# Altium schematic sheet [2] MicroController.SchDoc
size A4; SheetNumber: 2; SheetTotal: 3
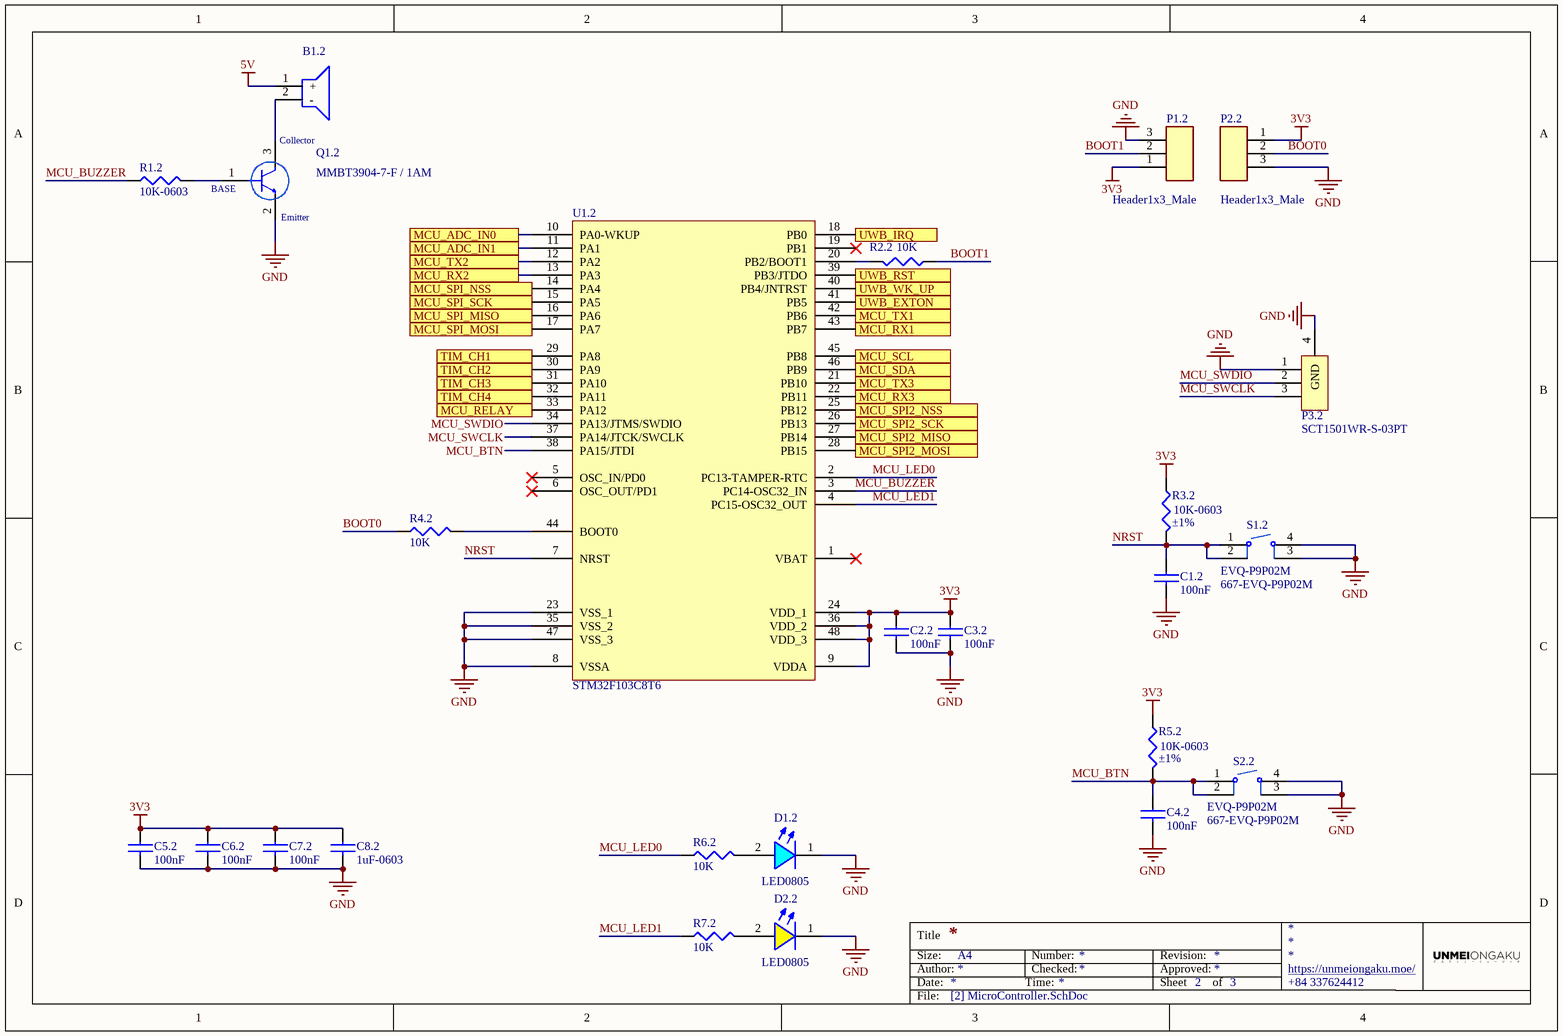
[diagram p0: [2] MicroController.SchDoc]

## Parts
B1.2  Buzzer  [Buzzer 9x5mm 60dB]  (value not drawn)
C1.2  100nF  [CAP0603]
C2.2  100nF  [CAP0603]
C3.2  100nF  [CAP0603]
C4.2  100nF  [CAP0603]
C5.2  100nF  [CAP0603]
C6.2  100nF  [CAP0603]
C7.2  100nF  [CAP0603]
C8.2  1uF-0603  [CAP0603]
D1.2  LED0805  [LED0805-BLUE]
D2.2  LED0805  [LED0805-YELLOW]
P1.2  Header1x3_Male  [HDR1x3_2.54_MALE]
P2.2  Header1x3_Male  [HDR1x3_2.54_MALE]
P3.2  SCT1501WR-S-03PT  [Connector ZH1.5 3P SMD]
Q1.2  MMBT3904-7-F / 1AM  [SOT23]
R1.2  10K-0603  [RES0603 - 3D]
R2.2  10K  [RES0603 - 3D]
R3.2  10K-0603  Tolerance: ±1%  [RES0603 - 3D]
R4.2  10K  [RES0603 - 3D]
R5.2  10K-0603  Tolerance: ±1%  [RES0603 - 3D]
R6.2  10K  [RES0603 - 3D]
R7.2  10K  [RES0603 - 3D]
S1.2  EVQ-P9P02M  Supplier Part Number 1: 667-EVQ-P9P02M  [TactileSwitch,SMT,4.2x3.2x2.5mm,4N]
S2.2  EVQ-P9P02M  Supplier Part Number 1: 667-EVQ-P9P02M  [TactileSwitch,SMT,4.2x3.2x2.5mm,4N]
U1.2  STM32F103C8T6  [LQFP48_L]

## Ports
MCU_ADC_IN0, MCU_ADC_IN1, MCU_RELAY, MCU_RX1, MCU_RX2, MCU_RX3, MCU_SCL, MCU_SDA, MCU_SPI2_MISO, MCU_SPI2_MOSI, MCU_SPI2_NSS, MCU_SPI2_SCK, MCU_SPI_MISO, MCU_SPI_MOSI, MCU_SPI_NSS, MCU_SPI_SCK, MCU_TX1, MCU_TX2, MCU_TX3, TIM_CH1, TIM_CH2, TIM_CH3, TIM_CH4, UWB_EXTON, UWB_IRQ, UWB_RST, UWB_WK_UP

## Nets
3V3: C2.2.1 C3.2.1 C5.2.1 C6.2.1 C7.2.1 C8.2.1 P1.2.1 P2.2.1 R3.2.1 R5.2.1 U1.2.9(VDDA) U1.2.24(VDD_1) U1.2.36(VDD_2) U1.2.48(VDD_3)
5V: B1.2.1(+)
GND: C1.2.2 C2.2.2 C3.2.2 C4.2.2 C5.2.2 C6.2.2 C7.2.2 C8.2.2 D1.2.1(+) D2.2.1(+) P1.2.3 P2.2.3 P3.2.1 P3.2.4(GND) Q1.2.2 S1.2.3 S1.2.4 S2.2.3 S2.2.4 U1.2.8(VSSA) U1.2.23(VSS_1) U1.2.35(VSS_2) U1.2.47(VSS_3)
BOOT0: P2.2.2 R4.2.1
BOOT1: P1.2.2 R2.2.1
MCU_ADC_IN0: U1.2.10(PA0-WKUP) ; port MCU_ADC_IN0
MCU_ADC_IN1: U1.2.11(PA1) ; port MCU_ADC_IN1
MCU_BTN: C4.2.1 R5.2.2 S2.2.1 S2.2.2 U1.2.38(PA15/JTDI)
MCU_BUZZER: R1.2.1 U1.2.3(PC14-OSC32_IN)
MCU_LED0: R6.2.1 U1.2.2(PC13-TAMPER-RTC)
MCU_LED1: R7.2.1 U1.2.4(PC15-OSC32_OUT)
MCU_RELAY: U1.2.33(PA12) ; port MCU_RELAY
MCU_RX1: U1.2.43(PB7) ; port MCU_RX1
MCU_RX2: U1.2.13(PA3) ; port MCU_RX2
MCU_RX3: U1.2.22(PB11) ; port MCU_RX3
MCU_SCL: U1.2.45(PB8) ; port MCU_SCL
MCU_SDA: U1.2.46(PB9) ; port MCU_SDA
MCU_SPI2_MISO: U1.2.27(PB14) ; port MCU_SPI2_MISO
MCU_SPI2_MOSI: U1.2.28(PB15) ; port MCU_SPI2_MOSI
MCU_SPI2_NSS: U1.2.25(PB12) ; port MCU_SPI2_NSS
MCU_SPI2_SCK: U1.2.26(PB13) ; port MCU_SPI2_SCK
MCU_SPI_MISO: U1.2.16(PA6) ; port MCU_SPI_MISO
MCU_SPI_MOSI: U1.2.17(PA7) ; port MCU_SPI_MOSI
MCU_SPI_NSS: U1.2.14(PA4) ; port MCU_SPI_NSS
MCU_SPI_SCK: U1.2.15(PA5) ; port MCU_SPI_SCK
MCU_SWCLK: P3.2.3 U1.2.37(PA14/JTCK/SWCLK)
MCU_SWDIO: P3.2.2 U1.2.34(PA13/JTMS/SWDIO)
MCU_TX1: U1.2.42(PB6) ; port MCU_TX1
MCU_TX2: U1.2.12(PA2) ; port MCU_TX2
MCU_TX3: U1.2.21(PB10) ; port MCU_TX3
NRST: C1.2.1 R3.2.2 S1.2.1 S1.2.2 U1.2.7(NRST)
TIM_CH1: U1.2.29(PA8) ; port TIM_CH1
TIM_CH2: U1.2.30(PA9) ; port TIM_CH2
TIM_CH3: U1.2.31(PA10) ; port TIM_CH3
TIM_CH4: U1.2.32(PA11) ; port TIM_CH4
UWB_EXTON: U1.2.41(PB5) ; port UWB_EXTON
UWB_IRQ: U1.2.18(PB0) ; port UWB_IRQ
UWB_RST: U1.2.39(PB3/JTDO) ; port UWB_RST
UWB_WK_UP: U1.2.40(PB4/JNTRST) ; port UWB_WK_UP
NetB1.2_2: B1.2.2(-) Q1.2.3
NetD1.2_2: D1.2.2(+) R6.2.2
NetD2.2_2: D2.2.2(+) R7.2.2
NetQ1.2_1: Q1.2.1 R1.2.2
NetR2.2_2: R2.2.2 U1.2.20(PB2/BOOT1)
NetR4.2_2: R4.2.2 U1.2.44(BOOT0)

Not connected (* = marked no-connect by the designer): U1.2 1(VBAT)* 5(OSC_IN/PD0)* 6(OSC_OUT/PD1)* 19(PB1)*

## Notes on the sheet
- Title
- Size:
- Date:
- Author:
- A4
- Time:
- Number:
- Checked:
- Revision:
- Sheet
- Approved:
- of
- https://unmeiongaku.moe/
- +84 337624412
- File:
- (in symbol MMBT3904-7-F / 1AM) Collector; BASE; Emitter

## Library data of the parts
B1.2 = Buzzer 9050 - DIP: 9050 DIP Buzzer 9x5mm 60dB; Local Supplier: thegioiic; Local Supplier Link: https://www.thegioiic.com/products/1209-dip-buzzer-12x9mm; Local Supplier Part Number: 1209 DIP Buzzer 12x9mm
C1.2 C2.2 C3.2 C4.2 C5.2 C6.2 C7.2 = CC0603KRX7R9BB104: CAP CER 0.1UF 50V X7R 0603; Manufacturer 1: Yageo; Category 1: Capacitors; Capacitance: 0.1µF; Tolerance: ±10%; Supplier 1: Digi-Key; Supplier Part Number 1: 311-1344-1-ND; Manufacturer Part Number 1: CC0603KRX7R9BB104; RoHS 1: RoHS Compliant; Description 1: CAP CER 0.1UF 50V X7R 0603; Stock 1: 4411645; Pricing 1: 1=0.1, 10=0.031, 100=0.014, 500=0.00998, 1000=0.00783 (USD); Packaging: Cut Tape (CT); Part Status: Active; Voltage - Rated: 50V; Temperature Coefficient: X7R; Operating Temperature: -55°C ~ 125°C; Features: -; Ratings: -; Applications: General Purpose; Failure Rate: -; Mounting Type: Surface Mount, MLCC; Package / Case: 0603 (1608 Metric); Size / Dimension: 0.063" L x 0.031" W (1.60mm x 0.80mm); Height - Seated (Max): -; Thickness (Max): 0.035" (0.90mm); Lead Spacing: -; Lead Style: -; ComponentLink1URL: http://www.yageo.com/documents/recent/UPY-GPHC_X7R_6.3V-to-50V_18.pdf; ComponentLink1Description: http://www.yageo.com/documents/recent/UPY-GPHC_X7R_6.3V-to-50V_18.pdf; Value: 100nF
C8.2 = CC0603KRX7R7BB105: CAP CER 1UF 16V X7R 0603; Manufacturer 1: Yageo; Category 1: Capacitors; Capacitance: 1µF; Tolerance: ±10%; Supplier 1: Digi-Key; Supplier Part Number 1: 311-1446-1-ND; Manufacturer Part Number 1: CC0603KRX7R7BB105; RoHS 1: RoHS Compliant; Description 1: CAP CER 1UF 16V X7R 0603; Stock 1: 274580; Pricing 1: 1=0.1, 10=0.051, 100=0.0227, 500=0.0162, 1000=0.01274 (USD); Packaging: Cut Tape (CT); Part Status: Active; Voltage - Rated: 16V; Temperature Coefficient: X7R; Operating Temperature: -55°C ~ 125°C; Features: -; Ratings: -; Applications: General Purpose; Failure Rate: -; Mounting Type: Surface Mount, MLCC; Package / Case: 0603 (1608 Metric); Size / Dimension: 0.063" L x 0.031" W (1.60mm x 0.80mm); Height - Seated (Max): -; Thickness (Max): 0.035" (0.90mm); Lead Spacing: -; Lead Style: -; ComponentLink1URL: http://www.yageo.com/documents/recent/UPY-GPHC_X7R_6.3V-to-50V_18.pdf; ComponentLink1Description: http://www.yageo.com/documents/recent/UPY-GPHC_X7R_6.3V-to-50V_18.pdf; Value: 1uF
D1.2 = LED0805-BLUE
D2.2 = LED0805-YELLOW
P1.2 P2.2 = HDR1x3_2.54_MALE: Header1x3_2.54_MALE
Q1.2 = MMBT3904-7-F / 1AM: Transistor General Purpose BJT NPN 40 Volt 0.2A Automotive 3-Pin SOT-23; Manufacturer: Diodes Zetex; Collector Emitter Breakdown Voltage: 40V; Max Power Dissipation: 300mW; Max Collector Current: 200mA; Transition Frequency: 300MHz; Collector Base Voltage (VCBO): 60V; Emitter Base Voltage (VEBO): 6V; Collector Emitter Saturation Voltage: 300mV; Element Configuration: Single; hFE Min: 100; Power Dissipation: 350mW; Number of Elements: 1; Supplier 1: Digi-Key; Manufacturer Part Number: MMBT3904-7-F; RoHS: Yes; Category: BJTs; Stock 1: 468030; Pricing 1: 3000=0.02271, 6000=0.02048, 15000=0.01781, 30000=0.01603, 75000=0.01425 (USD); Mount: Surface Mount; Case/Package: SOT-23; Number of Pins: 3; Contact Plating: Tin,Matte; Weight: 0.000282oz; Min Operating Temperature: -55°C; Max Operating Temperature: 150°C; Packaging: Tape and Reel; Polarity: NPN; Package Quantity: 3000; Collector Emitter Voltage (VCEO): 40V; Gain Bandwidth Product: 300MHz; Frequency: 300MHz; Max Breakdown Voltage: 40V; Series: -; Collector-emitter Voltage-Max: 300mV; Voltage Rating (DC): 40V; Max Frequency: 300MHz; Continuous Collector Current: 200mA; Length: 3.05mm; Width: 1.4mm; Height: 1mm; Radiation Hardening: No; RoHS Compliant: Yes; Lead Free: Lead Free; REACH SVHC: No SVHC; ComponentLink1URL: https://datasheet.ciiva.com/11201/ds30036-11201778.pdf?src-supplier=Avnet; ComponentLink1Description: https://datasheet.ciiva.com/11201/ds30036-11201778.pdf?src-supplier=Avnet; ComponentLink2URL: https://datasheet.ciiva.com/15138/getdatasheetpartid-53265-15138780.pdf?src-supplier=Verical; ComponentLink2Description: https://datasheet.ciiva.com/15138/getdatasheetpartid-53265-15138780.pdf?src-supplier=Verical; ComponentLink3URL: https://datasheet.ciiva.com/22711/1915516-22711750.pdf?src-supplier=Element14; ComponentLink3Description: https://datasheet.ciiva.com/22711/1915516-22711750.pdf?src-supplier=Element14; ComponentLink4URL: https://datasheet.ciiva.com/11198/ds30036-11198999.pdf?src-supplier=Avnet; ComponentLink4Description: https://datasheet.ciiva.com/11198/ds30036-11198999.pdf?src-supplier=Avnet; ComponentLink5URL: https://datasheet.ciiva.com/6361/ds30036-6361256.pdf?src-supplier=Digi-Key; ComponentLink5Description: https://datasheet.ciiva.com/6361/ds30036-6361256.pdf?src-supplier=Digi-Key; ComponentLink6URL: https://datasheet.ciiva.com/6361/ds30036-6361254.pdf?src-supplier=Digi-Key; ComponentLink6Description: https://datasheet.ciiva.com/6361/ds30036-6361254.pdf?src-supplier=Digi-Key; Supplier Part Number 1: MMBT3904-FDITR-ND
R1.2 = RC0603JR-0710KL: RES SMD 10K OHM 5% 1/10W 0603; Manufacturer 1: Yageo; Category 1: Resistors; Power (Watts): 0.1W, 1/10W; Temperature Coefficient: ±100ppm/°C; Supplier 1: Digi-Key; Supplier Part Number 1: 311-10KGRCT-ND; Manufacturer Part Number 1: RC0603JR-0710KL; RoHS 1: RoHS Compliant; Description 1: RES SMD 10K OHM 5% 1/10W 0603; Stock 1: 3056463; Pricing 1: 1=0.1, 10=0.011, 100=0.0044, 1000=0.00198, 2500=0.00172 (USD); Packaging: Cut Tape (CT); Part Status: Active; Resistance (Ohms): 10k; Tolerance: ±5%; Composition: Thick Film; Features: Moisture Resistant; Operating Temperature: -55°C ~ 155°C; Package / Case: 0603 (1608 Metric); Supplier Device Package: 0603; Size / Dimension: 0.063" L x 0.031" W (1.60mm x 0.80mm); Height - Seated (Max): 0.022" (0.55mm); Failure Rate: -; ComponentLink1URL: http://www.yageo.com/documents/recent/PYu-RC_Group_51_RoHS_L_7.pdf; ComponentLink1Description: http://www.yageo.com/documents/recent/PYu-RC_Group_51_RoHS_L_7.pdf; Value: 10K
R2.2 R3.2 R4.2 R5.2 R6.2 R7.2 = RC0603FR-0710KL: RES SMD 10K OHM 1% 1/10W 0603; Manufacturer: Yageo; Power (Watts): 0.1W, 1/10W; Temperature Coefficient: ±100ppm/°C; Supplier 1: Digi-Key; Manufacturer Part Number: RC0603FR-0710KL; RoHS: RoHS Compliant; Category: Resistors; Stock 1: 16545228; Pricing 1: 1=0.1, 10=0.015, 100=0.006, 1000=0.00268, 2500=0.00233 (USD); Packaging: Cut Tape (CT); Part Status: Active; Composition: Thick Film; Features: Moisture Resistant; Operating Temperature: -55°C ~ 155°C; Package / Case: 0603 (1608 Metric); Supplier Device Package: 0603; Size / Dimension: 0.063" L x 0.032" W (1.60mm x 0.80mm); Height - Seated (Max): 0.022" (0.55mm); Failure Rate: -; ComponentLink1URL: http://www.yageo.com/documents/recent/PYu-RC_Group_51_RoHS_L_7.pdf; ComponentLink1Description: http://www.yageo.com/documents/recent/PYu-RC_Group_51_RoHS_L_7.pdf; Supplier Part Number 1: 311-10.0KHRCT-ND; Value: 10K
  R2.2 R4.2 R6.2 R7.2: Tolerance: ±1%
S1.2 S2.2 = EVQ-P9P02M: Switch Tactile N.O. SPST Rectangular Button J-Bend 0.02A 15VDC 5N SMD Embossed Tape and Reel; Manufacturer: Panasonic; Mechanical Life: 200000Cycles; Operating Force: 500gf; Illumination Type: Non-Illuminated; Max Voltage Rating (DC): 15V; Switch Travel: 0.25mm; Switch Function: Off-Mom; Contact Current Rating: 20mA; Number of Positions: 2; Supplier 1: Mouser; Manufacturer Part Number: EVQ-P9P02M; RoHS: No; Category: Tactile Switches; Stock 1: 5205; Pricing 1: 1=0.83, 10=0.734, 50=0.734, 100=0.61, 1000=0.5, 10000=0.402 (USD); Mount: Surface Mount; Case/Package: SMD/SMT; Min Operating Temperature: -40°C; Max Operating Temperature: 85°C; Package Quantity: 4000; Packaging: Tape and Reel; Throw Configuration: SPST; Termination: J-Bend; Series: EVQP9; Size: 3.5mm; Radiation Hardening: No; Lead Free: Lead Free; RoHS Compliant: No; ComponentLink1URL: https://datasheet.ciiva.com/29974/atv0000ce7-29974075.pdf?src-supplier=Avnet; ComponentLink1Description: https://datasheet.ciiva.com/29974/atv0000ce7-29974075.pdf?src-supplier=Avnet; ComponentLink2URL: https://datasheet.ciiva.com/14920/atv0000ce7-14920757.pdf?src-supplier=Digikey; ComponentLink2Description: https://datasheet.ciiva.com/14920/atv0000ce7-14920757.pdf?src-supplier=Digikey; ComponentLink3URL: https://datasheet.ciiva.com/14920/atv0000ce7-14920758.pdf?src-supplier=Digikey; ComponentLink3Description: https://datasheet.ciiva.com/14920/atv0000ce7-14920758.pdf?src-supplier=Digikey
U1.2 = STM32F103C8T6: STM32 ARM-based 32-bit MCU with 64 Kbytes Flash, 48-pin LQFP, Industrial Temperature; ComponentLink1URL: www.st.com/stm32; ComponentLink1Description: Manufacturer Link; Published: 30-May-2008; DatasheetVersion: rev6, Mar-2008; PackageVersion: Mar-2008; PackageReference: LQFP48; Publisher: Altium Limited; PackageDescription: 48-Pin Low-Profile Quad Flat Pack, 7 x 7 mm Body, 0.5 mm Pitch (LQFP48); ComponentLink2Description: Datasheet; ComponentLink2URL: http://www.st.com/stonline/products/literature/ds/13587.pdf